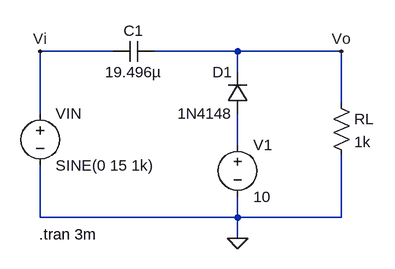
[diagram p0: schematic level_shifter_DCtransfer.asc]
level_shifter_DCtransfer.asc, the LTspice schematic file:
Version 4
SHEET 1 880 680
WIRE 0 96 -112 96
WIRE 192 96 64 96
WIRE 352 96 192 96
WIRE 192 128 192 96
WIRE 352 176 352 96
WIRE -112 192 -112 96
WIRE 192 240 192 192
WIRE -112 352 -112 272
WIRE 192 352 192 320
WIRE 192 352 -112 352
WIRE 352 352 352 256
WIRE 352 352 192 352
WIRE 192 384 192 352
FLAG 192 384 0
FLAG -112 96 Vi
FLAG 352 96 Vo
SYMBOL diode 208 192 R180
WINDOW 0 24 64 Left 2
WINDOW 3 24 0 Left 2
SYMATTR InstName D1
SYMATTR Value 1N4148
SYMBOL voltage 192 224 R0
WINDOW 123 0 0 Left 0
WINDOW 39 0 0 Left 0
SYMATTR InstName V1
SYMATTR Value 10
SYMBOL voltage -112 176 R0
WINDOW 123 0 0 Left 0
WINDOW 39 0 0 Left 0
SYMATTR InstName VIN
SYMATTR Value SINE(0 15 1k)
SYMBOL cap 64 80 R90
WINDOW 0 0 32 VBottom 2
WINDOW 3 32 32 VTop 2
SYMATTR InstName C1
SYMATTR Value 19.496µ
SYMBOL res 336 160 R0
SYMATTR InstName RL
SYMATTR Value 1k
TEXT -114 378 Left 2 !.tran 3m

The netlist it stands for:
* level_shifter_DCtransfer.asc
D1 N001 Vo 1N4148
V1 N001 0 10
VIN Vi 0 SINE(0 15 1k)
C1 Vo Vi 19.496µ
RL Vo 0 1k
.model D D
.lib standard.dio
.tran 3m
.backanno
.end